# EAGLE design LIGHT MODULE (EAGLE 9.6.2)
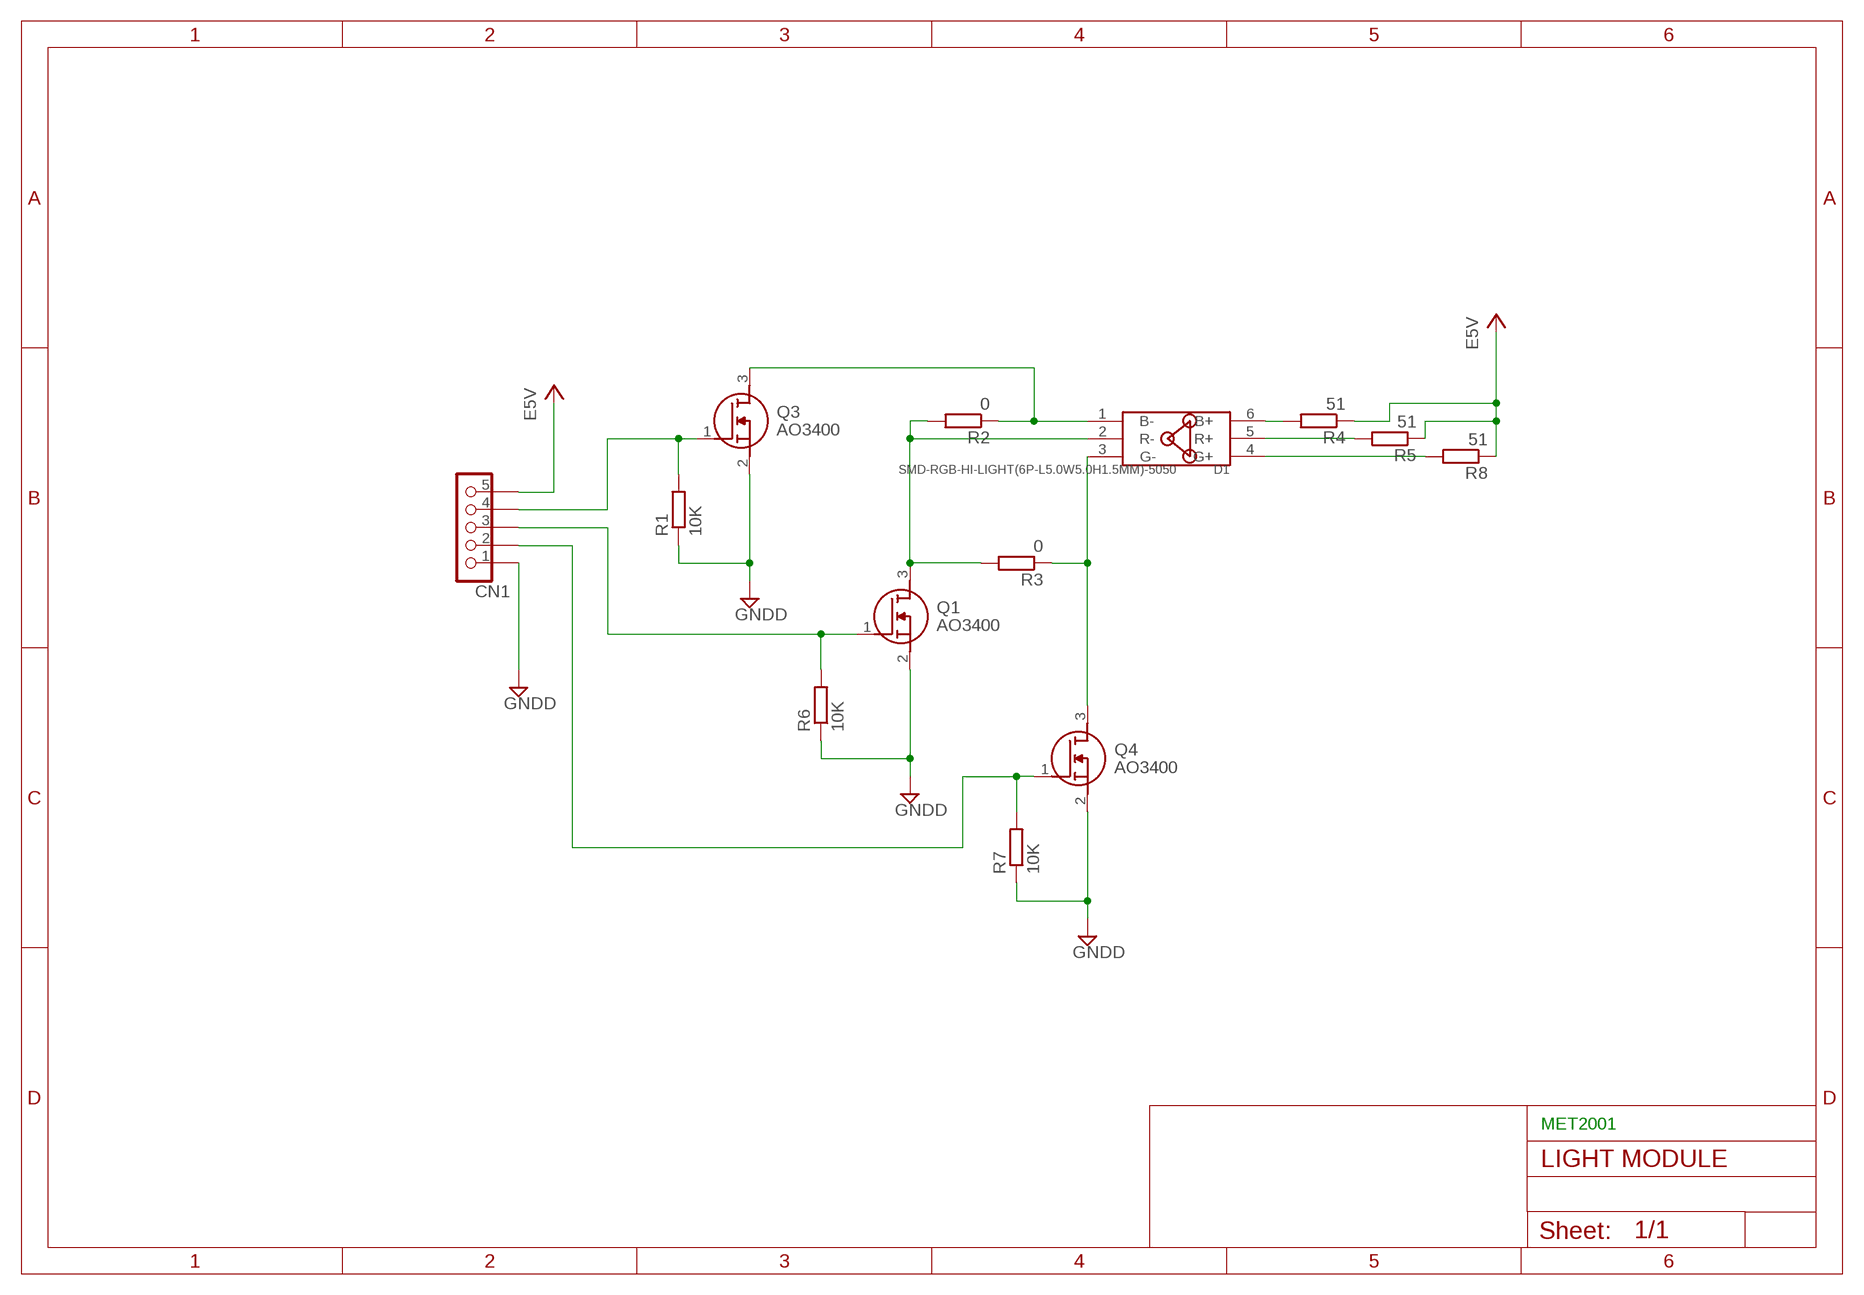
[diagram p0: schematic, sheet 1]

## Parts
CN1  HEADER1X5  [HEADER_1X5]
D1  SMD-RGB-HI-LIGHT(6P-L5.0W5.0H1.5MM)-5050  [LED6-SMD-5050]
Q1  AO3400  [SOT95P280X125-3N]
Q3  AO3400  [SOT95P280X125-3N]
Q4  AO3400  [SOT95P280X125-3N]
R1  10K  RES_0805  [R0805]
R2  0  RES_0805  [R0805]
R3  0  RES_0805  [R0805]
R4  51  RES_0805  [R0805]
R5  51  RES_0805  [R0805]
R6  10K  RES_0805  [R0805]
R7  10K  RES_0805  [R0805]
R8  51  RES_0805  [R0805]

## Nets
+5VA: CN1.5 R4.1 R5.1 R8.1 ; supply symbol labelled E5V
GNDD: CN1.1 Q1.2(S) Q3.2(S) Q4.2(S) R1.1 R6.1 R7.1
N$1: CN1.4 Q3.1(G) R1.2
N$2: D1.4(G+) R8.2
N$3: D1.5(R+) R5.2
N$5: D1.6(B+) R4.2
N$6: CN1.3 Q1.1(G) R6.2
N$7: D1.1(B-) Q3.3(D) R2.1
N$8: D1.2(R-) Q1.3(D) R2.2 R3.2
N$9: D1.3(G-) Q4.3(D) R3.1
N$15: CN1.2 Q4.1(G) R7.2

## Notes on the sheet
- MET2001

## Library data of the parts
CN1 = Power:HEADER1X5
D1 = SMD-RGB-HI-LIGHT_6P-L5.0_W5.0_H1.5MM_:SMD-RGB-HI-LIGHT(6P-L5.0*W5.0*H1.5MM): 304090049; AVAILABILITY: Unavailable; DESCRIPTION: Addressable Lighting - 1 LED Discrete PWM Red, Green, Blue (RGB) 5.00mm L x 5.00mm W; MF: SparkFun Electronics; MP: 5050RGB; PACKAGE: SparkFun Electronics; PRICE: None
Q1 Q3 Q4 = SamacSys_Parts:AO3400: 30V N-Channel MOSFET Source: Datasheet <http://aosmd.com/res/data_sheets/AO3400.pdf>; DESCRIPTION: 30V N-Channel MOSFET; HEIGHT: 1.25mm; MANUFACTURER_NAME: Alpha & Omega Semiconductors; MANUFACTURER_PART_NUMBER: AO3400
R1-R8 = Power:RES_0805

## Board
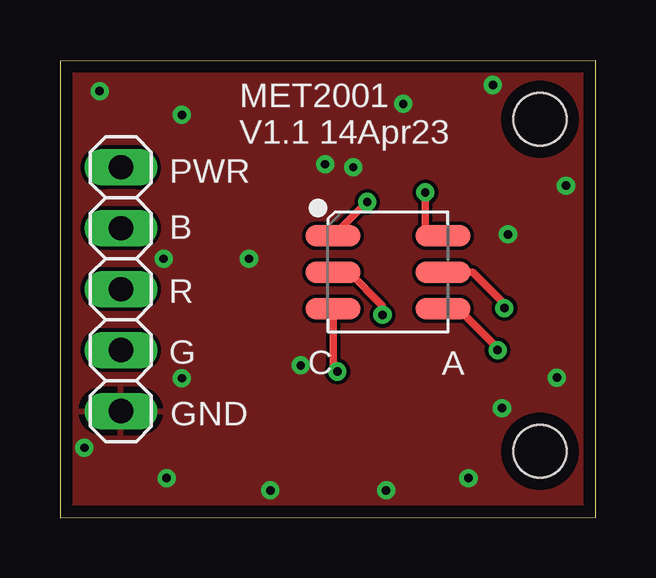
[diagram p1: board, top side]
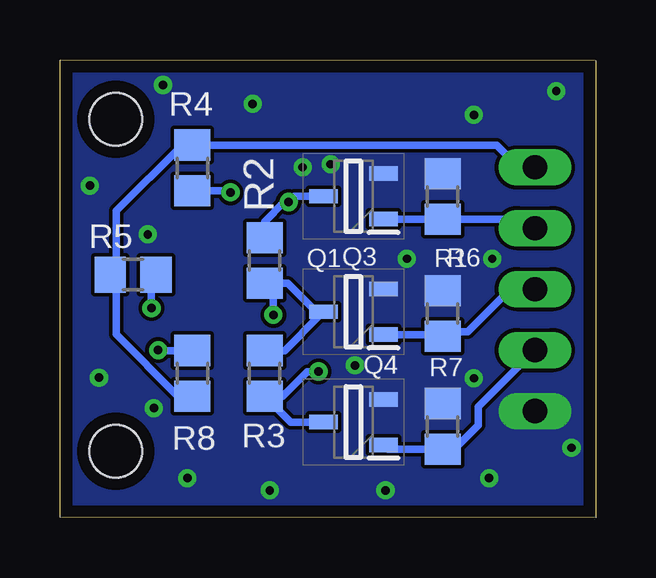
[diagram p2: board, bottom side, seen from below]

Size 22.33 x 19.08 mm. Coordinates in mm from the lower left corner, seen from the top.
Outline: 0,0 22.33,0.02 22.33,19.07 0,19.05 0,0
Copper layers (1*16): Top 0.035mm / dielectric 1.5mm / Bottom 0.035mm
Design rules "default *": minimum track width 10mil, minimum drill 0.35mm, track to track 6mil, track to pad 6mil, pad to pad 6mil, via to via 6mil, smd to smd 6mil, copper to edge 20mil, drill to drill 6mil, minimum pad ring 10mil, minimum via ring 8mil, stop-mask expansion 4mil, vias tented up to drill 15mil, thermal gap 10mil
Holes 2.2 mm at 20,2.77 20,16.61

### Footprints (pad centres in the part's own frame; a part is rotated, then mirrored left to right if it is on the bottom)
HEADER_1X5 = drill 1.016 long: 1 -6.35,0; 2 -3.81,0; 3 -1.27,0; 4 1.27,0; 5 3.81,0
LED6-SMD-5050 = smd 2.286 x 0.889: 1 -2.286,1.524; 2 -2.286,0; 3 -2.286,-1.524; 4 2.286,-1.524; 5 2.286,0; 6 2.286,1.524
SOT95P280X125-3N = smd 1.2 x 0.6: 1 -1.25,0.95; 2 -1.25,-0.95; 3 1.25,0
R0805 = smd 1.3 x 1.5: 1 -0.95,0; 2 0.95,0

### Placement (x,y rotation side)
CN1  2.54,10.79 90 top
D1  SMD-RGB-HI-LIGHT(6P-L5.0W5.0*H1.5MM)-5050  [LED6-SMD-5050]  13.67,10.24 0 top
Q1  10.1,8.59 180 bottom
Q3  10.1,13.4 180 bottom
Q4  10.1,3.99 180 bottom
R1  6.38,13.39 270 bottom
R2  13.8,10.72 270 bottom
R3  13.8,6.02 90 bottom
R4  16.81,14.58 270 bottom
R5  19.28,10.13 0 bottom
R6  6.38,8.51 270 bottom
R7  6.38,3.81 270 bottom
R8  16.81,6.02 90 bottom

### Tracks (layer width: path | path; a pad name or v marks a point on that pad's centre or on a via)
+5VA
  Bottom 0.305: CN1.5 3.2,14.61 4.12,15.53 R4.1 17.24,15.53 19.98,12.79 19.98,10.39 R5.1 19.99,9.9 19.99,7.64 17.41,5.07 R8.1
GNDD  (via drill 0.35)
  other vias: 4.45,1.65 13.59,1.14 8.76,1.14 17.02,1.65 20.7,5.84 21.08,13.84 14.3,17.25 18.03,18.03 5.08,16.79 4.32,10.79 5.08,5.82 10.03,6.35 7.87,10.79 11.05,14.73 12.22,14.61 18.67,11.81 1.65,17.78 1.02,2.92 18.41,4.57
  pour Top (rank 2): 0,-0.64 22.89,-0.64 22.89,19.05 0,19.05
  pour Bottom (no thermals): 0,-0.64 22.89,-0.64 22.89,18.92 0,18.92
N$1
  Bottom 0.305: CN1.4 2.91,12.44 R1.2 8.84,12.44 Q3.1
N$2  (via drill 0.35)
  Top 0.305: D1.4 16.59,8.71 18.24,7.06 v18.24,6.98
  Bottom 0.305: v18.24,6.98 18.22,6.97 R8.2
N$3  (via drill 0.35)
  Top 0.305: v18.52,8.74 18.52,8.91 17.2,10.24 D1.5
  Bottom 0.305: R5.2 18.52,9.95 v18.52,8.74
N$5  (via drill 0.35)
  Top 0.305: D1.6 15.47,11.76 15.22,12.01 v15.22,13.56
  Bottom 0.305: v15.22,13.56 15.36,13.56 15.43,13.63 R4.2
N$6
  Bottom 0.305: CN1.3 3.56,9.53 5.33,7.75 6.19,7.75 R6.2 6.46,7.63 Q1.1
N$7  (via drill 0.35)
  Top 0.305: v12.8,13.16 12.78,13.16 D1.1
  Bottom 0.305: R2.1 13.8,12.34 12.99,13.14 12.8,13.14 v12.8,13.16 12.56,13.4 Q3.3
N$8  (via drill 0.35)
  Top 0.305: D1.2 12.04,10.24 13.44,8.85 v13.44,8.46
  Bottom 0.305: Q1.3 11.5,8.43 | 11.5,8.43 12.96,6.97 R3.2 | 11.5,8.43 12.84,9.77 R2.2 13.44,9.4 v13.44,8.46
N$9  (via drill 0.35)
  Top 0.305: D1.3 11.38,6.27 v11.56,6.1
  Bottom 0.305: Q4.3 12.72,3.99 R3.1 13.04,5.07 12.01,6.1 v11.56,6.1
N$15
  Bottom 0.305: Q4.1 8.67,2.86 R7.2 5.9,2.86 4.9,3.86 4.9,4.62 CN1.2

### Text on the board
tNames: MET2001 / V1.1 14Apr23 | PWR | B | R | G | C | A | GND